# EAGLE schematic W5200 Ethernet Shield v10 (EAGLE 6.1)
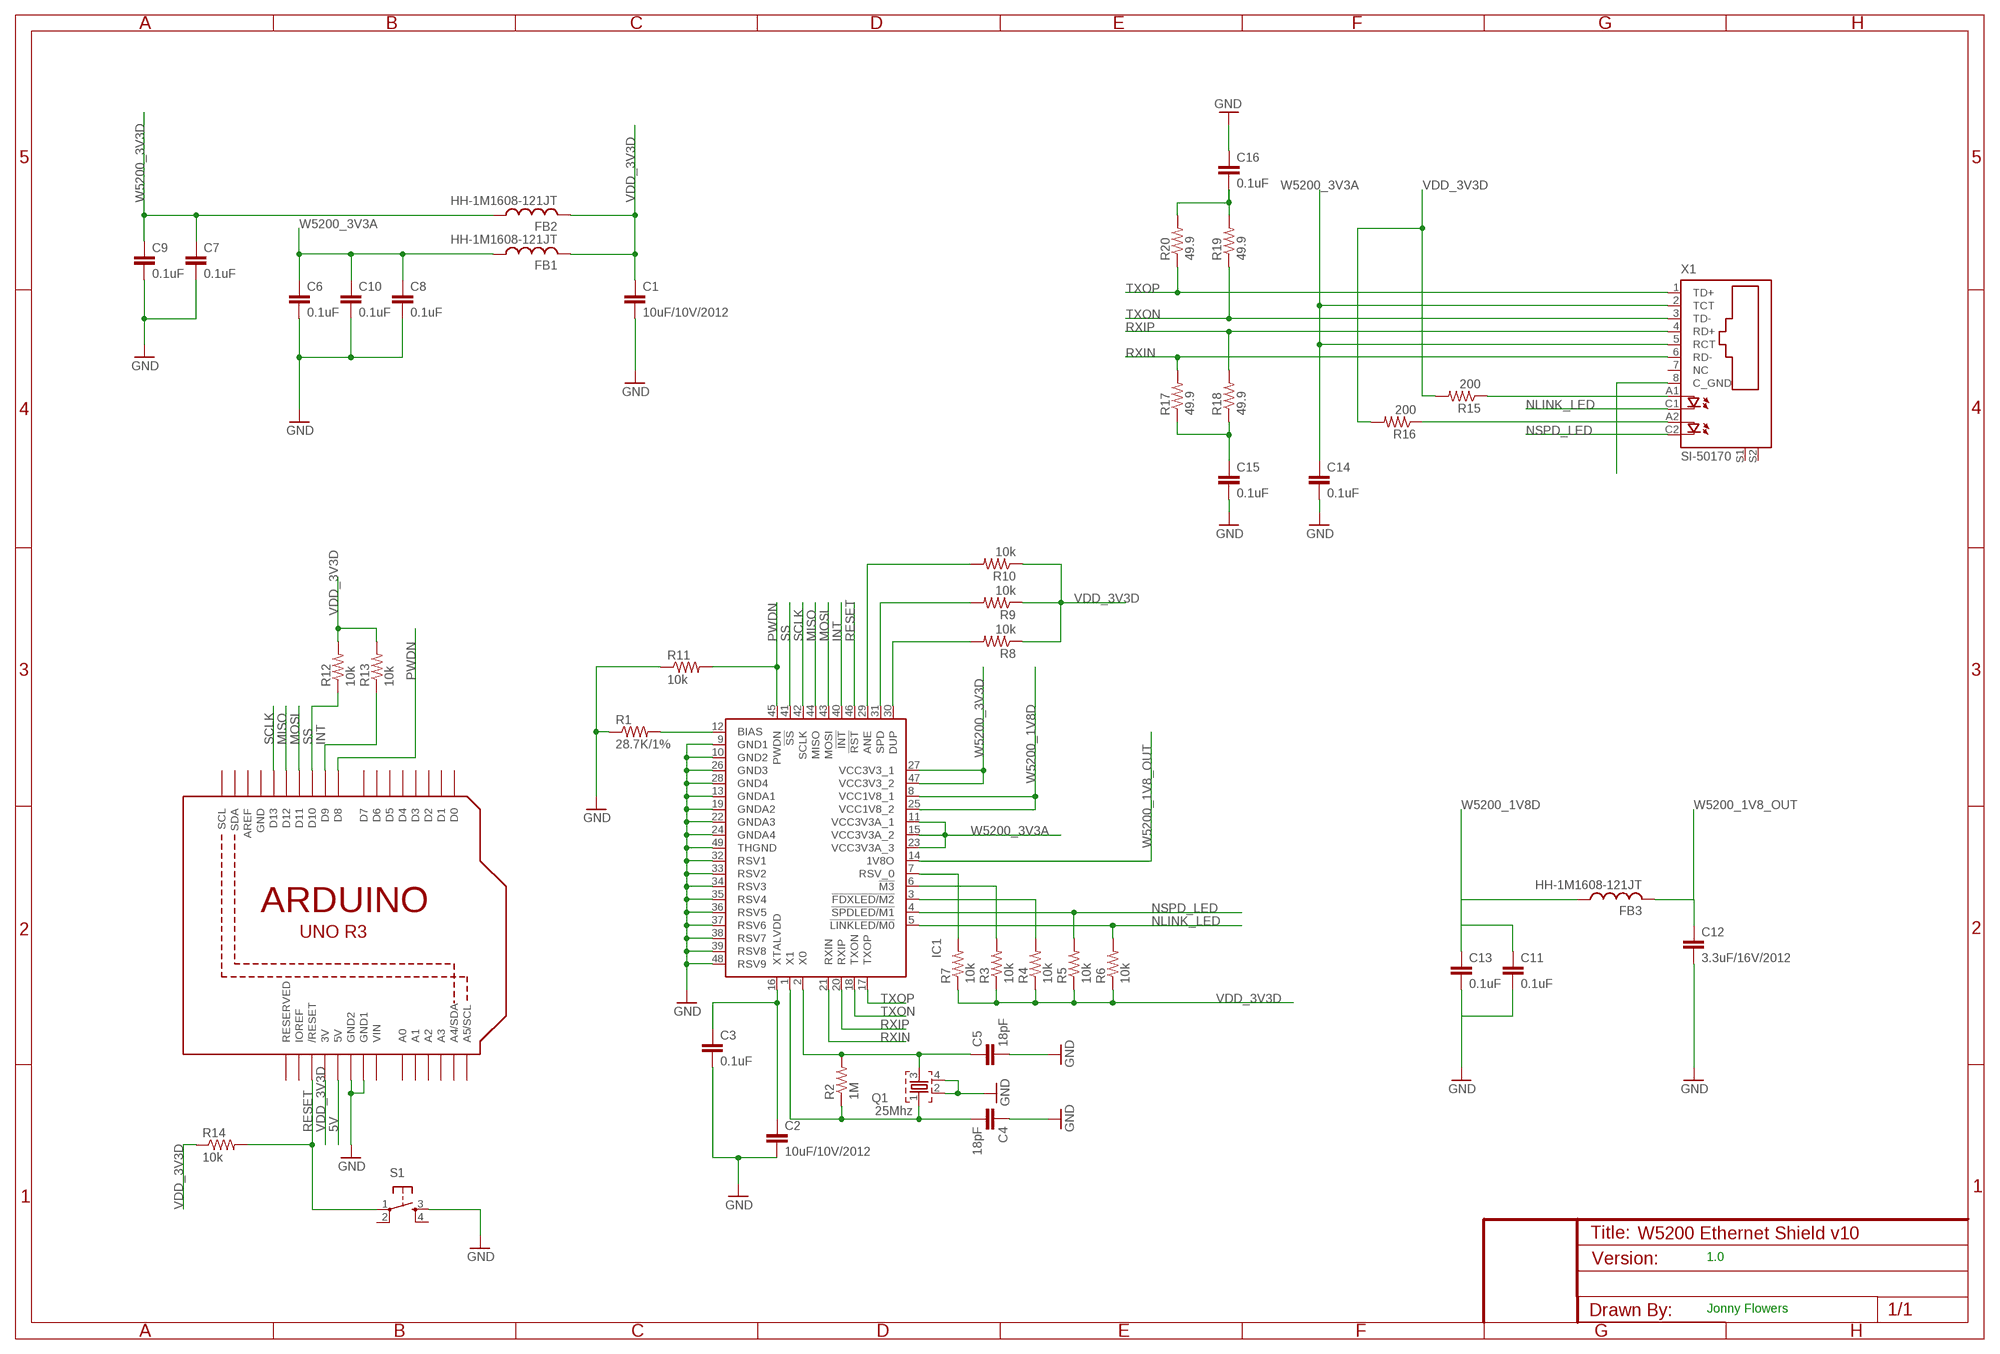
[diagram p0: schematic, sheet 1]

## Parts
C1  10uF/10V/2012  CAP1206  [1206]
C2  10uF/10V/2012  CAP1206  [1206]
C3  0.1uF  CAP1206  [1206]
C4  18pF  CAP1206  [1206]
C5  18pF  CAP1206  [1206]
C6  0.1uF  CAP1206  [1206]
C7  0.1uF  CAP1206  [1206]
C8  0.1uF  CAP1206  [1206]
C9  0.1uF  CAP1206  [1206]
C10  0.1uF  CAP1206  [1206]
C11  0.1uF  CAP1206  [1206]
C12  3.3uF/16V/2012  CAP1206  [1206]
C13  0.1uF  CAP1206  [1206]
C14  0.1uF  CAP1206  [1206]
C15  0.1uF  CAP1206  [1206]
C16  0.1uF  CAP1206  [1206]
FB1  HH-1M1608-121JT  FB  [FB]
FB2  HH-1M1608-121JT  FB  [FB]
FB3  HH-1M1608-121JT  FB  [FB]
IC1  W5200-QFN48  [QFN48]
Q1  25Mhz  FA-20H  [FA-20H]
R1  28.7K/1%  RESISTOR1206  [1206]
R2  1M  RESISTOR1206  [1206]
R3  10k  RESISTOR1206  [1206]
R4  10k  RESISTOR1206  [1206]
R5  10k  RESISTOR1206  [1206]
R6  10k  RESISTOR1206  [1206]
R7  10k  RESISTOR1206  [1206]
R8  10k  RESISTOR1206  [1206]
R9  10k  RESISTOR1206  [1206]
R10  10k  RESISTOR1206  [1206]
R11  10k  RESISTOR1206  [1206]
R12  10k  RESISTOR1206  [1206]
R13  10k  RESISTOR1206  [1206]
R14  10k  RESISTOR1206  [1206]
R15  200  RESISTOR1206  [1206]
R16  200  RESISTOR1206  [1206]
R17  49.9  RESISTOR1206  [1206]
R18  49.9  RESISTOR1206  [1206]
R19  49.9  RESISTOR1206  [1206]
R20  49.9  RESISTOR1206  [1206]
S1  TAC_SWITCHSMD  [TACTILE_SWITCH_SMD]
U1  ARDUINOR3-DIMENSION  [ARDUINOR3]
X1  SI-50170  [SI-50170]

## Nets
5V: U1.5V
GND: C1.2 C2.2 C3.2 C4.1 C5.2 C6.2 C7.2 C8.2 C9.2 C10.2 C11.2 C12.2 C13.2 C14.2 C15.2 C16.1 IC1.9(GND1) IC1.10(GND2) IC1.13(GNDA1) IC1.19(GNDA2) IC1.22(GNDA3) IC1.24(GNDA4) IC1.26(GND3) IC1.28(GND4) IC1.32(RSV1) IC1.33(RSV2) IC1.34(RSV3) IC1.35(RSV4) IC1.36(RSV5) IC1.37(RSV6) IC1.38(RSV7) IC1.39(RSV8) IC1.48(RSV9) IC1.49(THGND) Q1.2 Q1.4 R1.1 R11.1 S1.3 U1.GND1 U1.GND2
INT: IC1.40(!INT) R13.1 U1.D9
MISO: IC1.44(MISO) U1.D12
MOSI: IC1.43(MOSI) U1.D11
N$1: C4.2 IC1.1(X1) Q1.1 R2.1
N$2: IC1.12(BIAS) R1.2
N$3: C5.1 IC1.2(X0) Q1.3 R2.2
N$4: C2.1 C3.1 IC1.16(XTALVDD)
N$5: IC1.6(!M3) R3.2
N$6: IC1.3(!FDXLED/M2) R4.2
N$7: IC1.30(DUP) R8.2
N$8: IC1.7(RSV_0) R7.2
N$9: IC1.31(SPD) R9.2
N$10: IC1.29(ANE) R10.2
N$11: C16.2 R19.2 R20.2
N$12: C15.1 R17.1 R18.1
N$13: R16.1 X1.A2(A1)
N$14: R15.1 X1.A1(A)
N$15: X1.8(C_GND)
NLINK_LED: IC1.5(!LINKLED/M0) R6.2 X1.C1(C)
NSPD_LED: IC1.4(!SPDLED/M1) R5.2 X1.C2(C1)
PWDN: IC1.45(PWDN) R11.2 U1.D8
RESET: IC1.46(!RST) R14.2 S1.1 U1.RESET(/RESET)
RXIN: IC1.21(RXIN) R17.2 X1.6(RD-)
RXIP: IC1.20(RXIP) R18.2 X1.4(RD+)
SCLK: IC1.42(SCLK) U1.D13
SS: IC1.41(!SS) R12.1 U1.D10
TXON: IC1.18(TXON) R19.1 X1.3(TD-)
TXOP: IC1.17(TXOP) R20.1 X1.1(TD+)
VDD_3V3D: C1.1 FB1.P$2 FB2.P$2 R3.1 R4.1 R5.1 R6.1 R7.1 R8.1 R9.1 R10.1 R12.2 R13.2 R14.1 R15.2 R16.2 U1.3V
W5200_1V8_OUT: C12.1 FB3.P$2 IC1.14(1V8O)
W5200_1V8D: C11.1 C13.1 FB3.P$1 IC1.8(VCC1V8_1) IC1.25(VCC1V8_2)
W5200_3V3A: C6.1 C8.1 C10.1 C14.1 FB1.P$1 IC1.11(VCC3V3A_1) IC1.15(VCC3V3A_2) IC1.23(VCC3V3A_3) X1.2(TCT) X1.5(RCT)
W5200_3V3D: C7.1 C9.1 FB2.P$1 IC1.27(VCC3V3_1) IC1.47(VCC3V3_2)
Unconnected: S1.2 S1.4 U1.A0 U1.A1 U1.A2 U1.A3 U1.A4(A4/SDA) U1.A5(A5/SCL) U1.AREF U1.D0 U1.D1 U1.D2 U1.D3 U1.D4 U1.D5 U1.D6 U1.D7 U1.IOREF U1.RESERVED U1.SCL U1.SDA X1.7(NC) X1.S1 X1.S2

## Notes on the sheet
- 1.0
- Jonny Flowers

## Power pins joined to a net without a drawn wire
GND: U1.GND
VIN: U1.VIN

## Library data of the parts
C1-C16 = SparkFun:CAP: Capacitor Standard 0603 ceramic capacitor, and 0.1" leaded capacitor.
FB1-FB3 = adafruit:FB: Ferrite bead Digikey #P9821BK-ND
IC1 = WIZnet:W5200: W5200 http://www.wiznet.co.kr/Sub_Modules/en/product/product_detail.asp?Refid=408&page=1&cate1=5&cate2=38&cate3=0&pid=1144&cType=2; OC_DACOM: W5200-QFN48
Q1 = crystal:FA-: MHz RANGE CRYSTAL UNIT Source: Epson Toyocom
R1-R20 = SparkFun:RESISTOR: Resistor Basic schematic elements and footprints for 0603, 1206, and PTH resistors.
S1 = SparkFun:TAC_SWITCH: Momentary Switch Button commonly used for reset or general input. Spark Fun Electronics SKU : COM-00097
U1 = adafruit:ARDUINOR3: This is a new object for the new Arduino R3 - with extra pins that you may want to use (such as IOref, and duplicated A4/A5
X1 = con-stewart:SI-50170: Ethernet Connector MagJack (R) Source: www.stewartconnector.com .. si-50170.pdf; OC_FARNELL: unknown; OC_NEWARK: unknown